# EAGLE design control-10 (EAGLE 7.7.0)
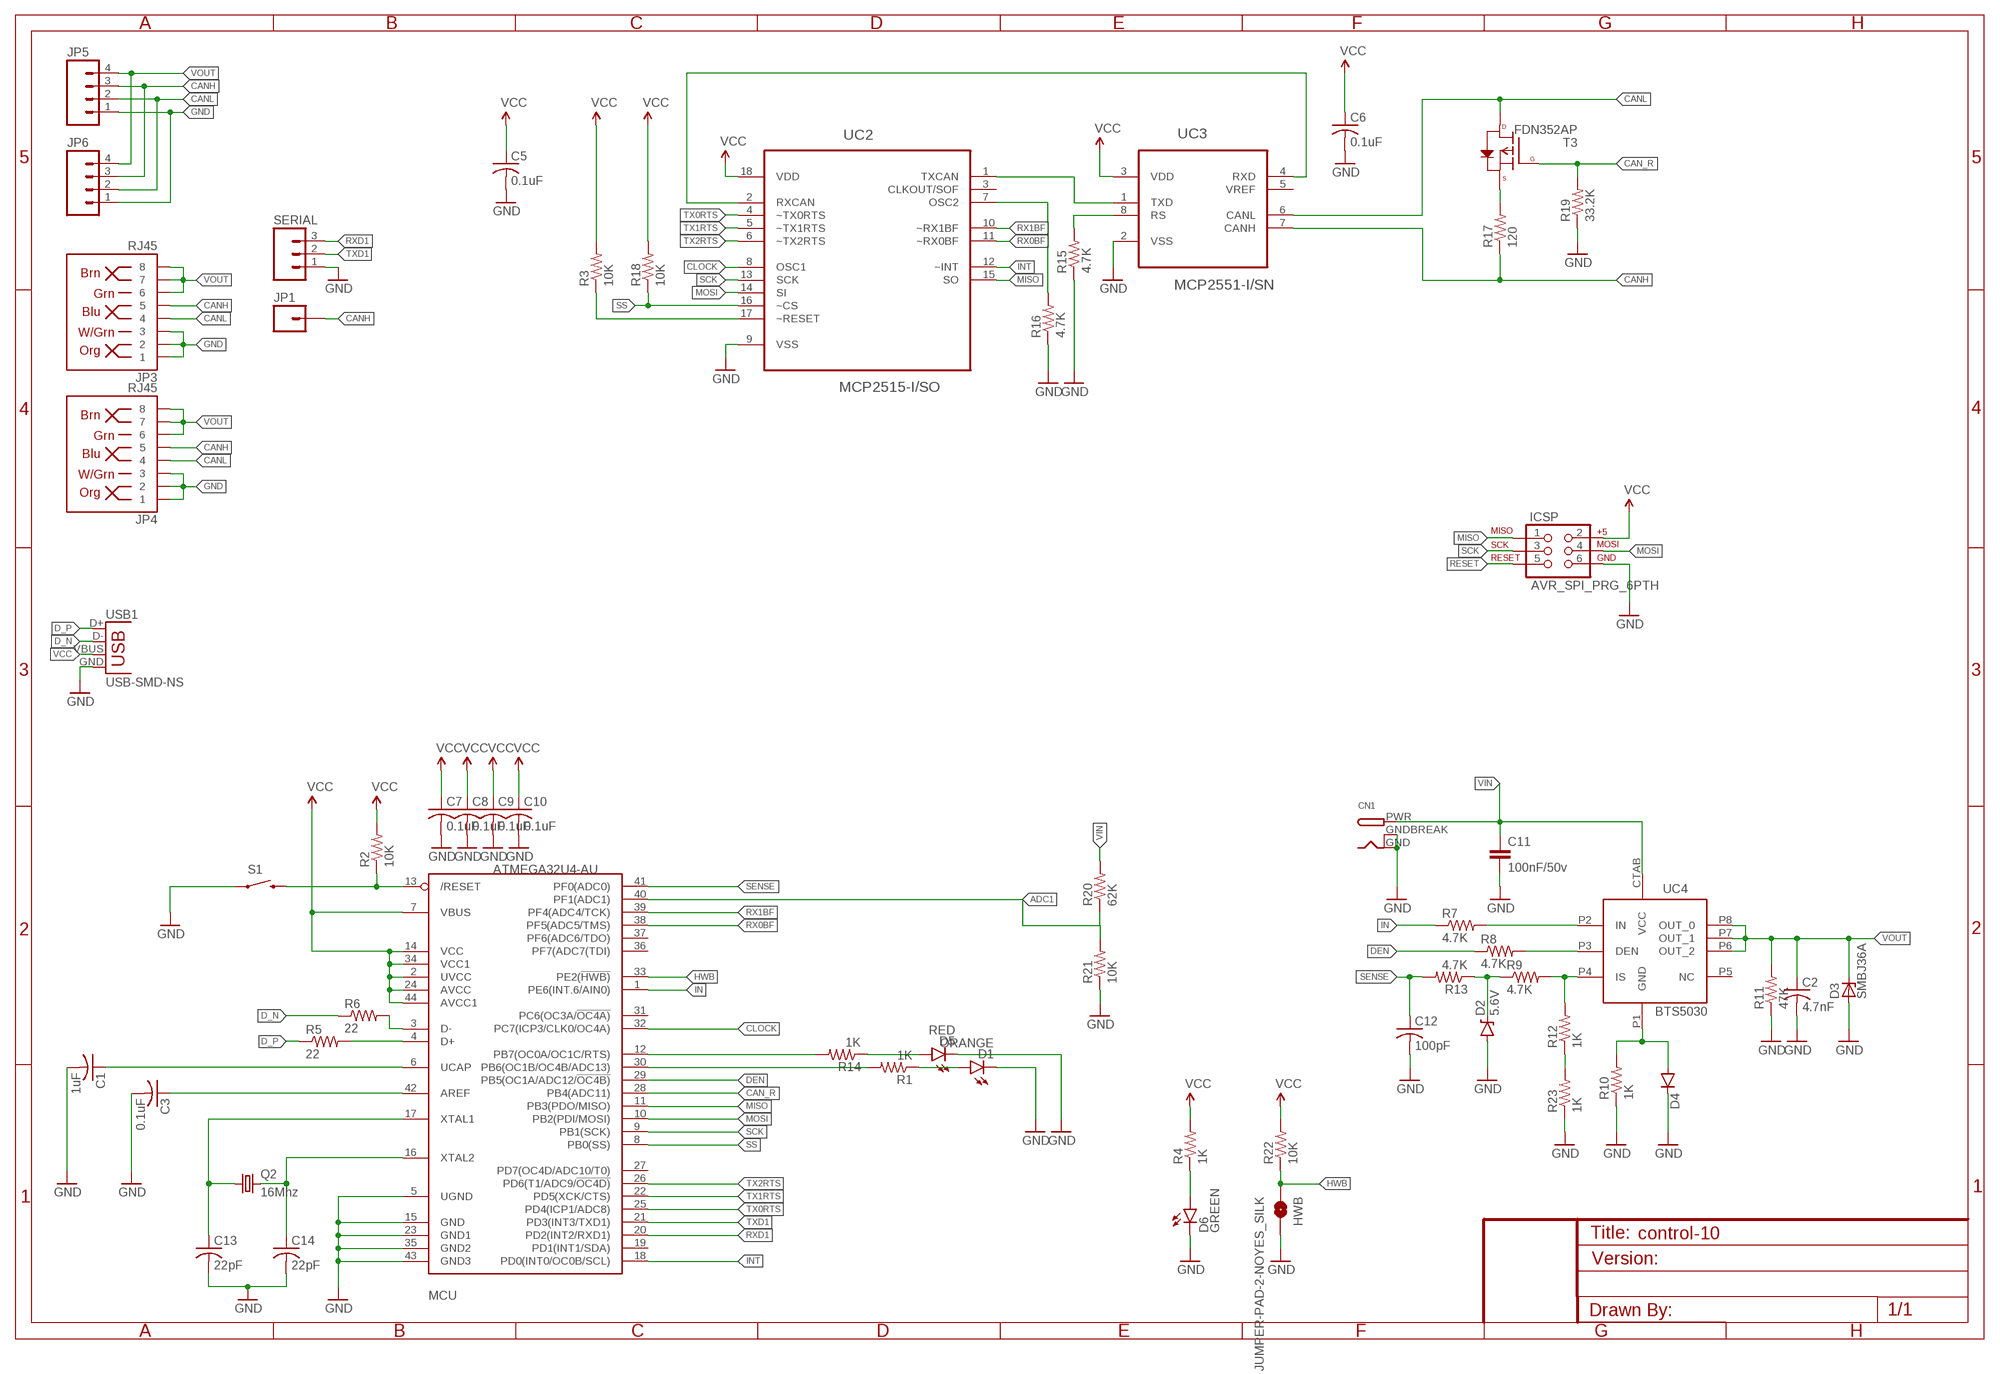
[diagram p0: schematic, sheet 1]

## Parts
C1  1uF  C-USC0805  [C0805]
C2  4.7nF  C-USC0805  [C0805]
C3  0.1uF  C-USC0603  [C0603]
C5  0.1uF  C-USC0603  [C0603]
C6  0.1uF  C-USC0603  [C0603]
C7  0.1uF  C-USC0603  [C0603]
C8  0.1uF  C-USC0603  [C0603]
C9  0.1uF  C-USC0603  [C0603]
C10  0.1uF  C-USC0603  [C0603]
C11  100nF/50v  CAP0805  [0805]
C12  100pF  C-USC0805  [C0805]
C13  22pF  C-USC0805  [C0805]
C14  22pF  C-USC0805  [C0805]
CN1  DCBARRELPTH  [DCJACK_2MM_PTH]
D1  ORANGE  LED1206  [LED-1206]
D2  5.6V  DIODE-ZENER5.6V  [SOD-323]
D3  SMBJ36A  ZENER-DIODESMB  [SMB]
D4  DIODESMA  [SMA-DIODE]
D5  RED  LED1206  [LED-1206]
D6  GREEN  LED1206  [LED-1206]
HWB  JUMPER-PAD-2-NOYES_SILK  [PAD-JUMPER-2-NO_YES_SILK]
ICSP  AVR_SPI_PRG_6PTH  [2X3]
JP1  M01NOSILK-KIT  [1X01NS-KIT]
JP3  RJ45  RJ45-8PTH  [RJ45-8]
JP4  RJ45  RJ45-8PTH  [RJ45-8]
JP5  M04SCREW  [SCREWTERMINAL-3.5MM-4]
JP6  M04SCREW  [SCREWTERMINAL-3.5MM-4]
MCU  ATMEGA32U4-AU  [TQFP44]
Q2  16Mhz  CRYSTALSMD  [HC49UP]
R1  1K  RESISTOR0805-RES  [0805]
R2  10K  R-US_M0805  [M0805]
R3  10K  R-US_M0805  [M0805]
R4  1K  RESISTOR0805-RES  [0805]
R5  22  R-US_M0805  [M0805]
R6  22  R-US_M0805  [M0805]
R7  4.7K  R-US_M0805  [M0805]
R8  4.7K  R-US_M0805  [M0805]
R9  4.7K  R-US_M0805  [M0805]
R10  1K  R-US_M0805  [M0805]
R11  47K  R-US_M0805  [M0805]
R12  1K  R-US_M0805  [M0805]
R13  4.7K  R-US_M0805  [M0805]
R14  1K  RESISTOR0805-RES  [0805]
R15  4.7K  R-US_M0805  [M0805]
R16  4.7K  R-US_M0805  [M0805]
R17  120  R-US_M0805  [M0805]
R18  10K  R-US_M0805  [M0805]
R19  33.2K  R-US_M0805  [M0805]
R20  62K  R-US_M0805  [M0805]
R21  10K  R-US_M0805  [M0805]
R22  10K  R-US_M0805  [M0805]
R23  1K  R-US_M0805  [M0805]
S1  SWITCH-MOMENTARY-2SMD-1101NE  [TACTILE-SWITCH-1101NE]
SERIAL  M03PTH  [1X03]
T3  FDN352AP  P-CHANNEL-MOSFET  [SOT23-3]
UC2  MCP2515-I/SO  [SOIC127P1034X264-18N]
UC3  MCP2551-I/SN  [SOIC127P600X175-8N]
UC4  BTS5030  [PG-DSO-8-43]
USB1  USB-SMD-NS  [USB-MINIB-NOSTOP]

## Nets
ADC1: MCU.40(PF1(ADC1)) R20.1 R21.2
CAN_R: MCU.28(PB4(ADC11)) R19.2 T3.1(G)
CANH: JP1.1 JP3.5 JP4.5 JP5.3 JP6.3 R17.1 UC3.7(CANH)
CANL: JP3.4 JP4.4 JP5.2 JP6.2 T3.3(D) UC3.6(CANL)
CLOCK: MCU.32(PC7(ICP3/CLK0/OC4A)) UC2.8(OSC1)
D_N: R6.1 USB1.D-
D_P: R5.1 USB1.D+
DEN: MCU.29(PB5(OC1A/ADC12/!OC4B)) R8.1
DU_N: MCU.3(D-) R6.2
DU_P: MCU.4(D+) R5.2
GND: C1.2 C2.2 C3.2 C5.2 C6.2 C7.2 C8.2 C9.2 C10.2 C11.2 C12.2 C13.2 C14.2 CN1.GND CN1.GNDBREAK D1.C D2.A D3.A D4.C D5.C D6.C HWB.2 ICSP.6 JP3.1 JP3.2 JP3.3 JP4.1 JP4.2 JP4.3 JP5.1 JP6.1 MCU.5(UGND) MCU.15(GND) MCU.23(GND1) MCU.35(GND2) MCU.43(GND3) R10.1 R11.1 R15.1 R16.1 R19.1 R21.1 R23.1 S1.1 SERIAL.1 UC2.9(VSS) UC3.2(VSS) USB1.GND
HWB: HWB.1 MCU.33(PE2(!HWB)) R22.1
IN: MCU.1(PE6(INT.6/AIN0)) R7.1
INT: MCU.18(PD0(INT0/OC0B/SCL)) UC2.12(~INT)
MISO: ICSP.1 MCU.11(PB3(PDO/MISO)) UC2.15(SO)
MOSI: ICSP.4 MCU.10(PB2(PDI/MOSI)) UC2.14(SI)
N$1: C13.1 MCU.17(XTAL1) Q2.1
N$2: D1.A R1.1
N$3: R7.2 UC4.P2(IN)
N$4: UC2.1(TXCAN) UC3.1(TXD)
N$5: C14.1 MCU.16(XTAL2) Q2.2
N$6: UC2.2(RXCAN) UC3.4(RXD)
N$7: R16.2 UC2.7(OSC2)
N$8: R12.1 R23.2
N$9: R3.1 UC2.17(~RESET)
N$10: R8.2 UC4.P3(DEN)
N$11: R15.2 UC3.8(RS)
N$13: R17.2 T3.2(S)
N$14: R9.2 R12.2 UC4.P4(IS)
N$15: D4.A R10.2 UC4.P1(GND)
N$16: MCU.12(PB7(OC0A/OC1C/RTS)) R14.2
N$17: D2.C R9.1 R13.1
N$18: MCU.30(PB6(OC1B/OC4B/ADC13)) R1.2
N$19: D5.A R14.1
N$21: C3.1 MCU.42(AREF)
N$22: D6.A R4.1
N$23: C1.1 MCU.6(UCAP)
RESET: ICSP.5 MCU.13(/RESET) R2.1 S1.2
RX0BF: MCU.38(PF5(ADC5/TMS)) UC2.11(~RX0BF)
RX1BF: MCU.39(PF4(ADC4/TCK)) UC2.10(~RX1BF)
RXD1: MCU.20(PD2(INT2/RXD1)) SERIAL.3
SCK: ICSP.3 MCU.9(PB1(SCK)) UC2.13(SCK)
SENSE: C12.1 MCU.41(PF0(ADC0)) R13.2
SS: MCU.8(PB0(SS)) R18.1 UC2.16(~CS)
TX0RTS: MCU.25(PD4(ICP1/ADC8)) UC2.4(~TX0RTS)
TX1RTS: MCU.22(PD5(XCK/CTS)) UC2.5(~TX1RTS)
TX2RTS: MCU.26(PD6(T1/ADC9/!OC4D)) UC2.6(~TX2RTS)
TXD1: MCU.21(PD3(INT3/TXD1)) SERIAL.2
VCC: C5.1 C6.1 C7.1 C8.1 C9.1 C10.1 ICSP.2 MCU.2(UVCC) MCU.7(VBUS) MCU.14(VCC) MCU.24(AVCC) MCU.34(VCC1) MCU.44(AVCC1) R2.2 R3.2 R4.2 R18.2 R22.2 UC2.18(VDD) UC3.3(VDD) USB1.VBUS
VIN: C11.1 CN1.PWR R20.2 UC4.CTAB(VCC)
VOUT: C2.1 D3.C JP3.6 JP3.7 JP3.8 JP4.6 JP4.7 JP4.8 JP5.4 JP6.4 R11.2 UC4.P6(OUT_2) UC4.P7(OUT_1) UC4.P8(OUT_0)
Unconnected: MCU.19(PD1(INT1/SDA)) MCU.27(PD7(OC4D/ADC10/T0)) MCU.31(PC6(OC3A/!OC4A)) MCU.36(PF7(ADC7(TDI)) MCU.37(PF6(ADC6/TDO)) UC2.3(CLKOUT/SOF) UC3.5(VREF) UC4.P5(NC)

## Library data of the parts
C1-C3 C5-C10 C12-C14 = rcl:C-US: CAPACITOR, American symbol
C11 = SparkFun-Capacitors:CAP: Capacitor Standard 0603 ceramic capacitor, and 0.1" leaded capacitor.
CN1 = adafruit:DCBARREL: 2.0mm DC Barrel Jack DCJACK_2MM_PTH - Through Hole Jack (4UConnector: 05537)
D1 D5 D6 = SparkFun-LED:LED: LEDs Standard schematic elements and footprints for 5mm, 3mm, 1206, and 0603 sized LEDs. 5mm - Spark Fun Electronics SKU : COM-00529 (and others)
D2 = SparkFun-DiscreteSemi:DIODE-ZENER: Zener Diode Production Part - 8199 3.4V Zener Voltage; PROD_ID: DIO-12442
D3 = diode:ZENER-DIODE: Z-Diode
D4 = SparkFun-DiscreteSemi:DIODE: Diode These are standard reverse protection diodes and small signal diodes. SMA package can handle up to about 1A. SOD-323 can handle about 200mA. What the SOD-323 package when ordering, there are some mfgs out there that are 5-pin packages.
HWB = SparkFun-Passives:JUMPER-PAD-2-NO
ICSP = SparkFun-Connectors:AVR_SPI_PRG_6: AVR ISP 6 Pin This is the reduced ISP connector for AVR programming. Common on Arduino. This footprint will take up less PCB space and can be used with a 10-pin to 6-pin adapter such as SKU: BOB-08508 **Special note about "TEST_POINT" package. The stop mask is on the top side, so if you want your programming test points to be on the bottom of your board, make sure to place this package on the bottom side of the board. This also ensure that the orientation to program from the bottom side will be correct.
JP1 = SparkFun-Connectors:M01: Header 1 Standard 1-pin 0.1" header. Use with straight break away headers (SKU : PRT-00116), right angle break away headers (PRT-00553), swiss pins (PRT-00743), machine pins (PRT-00117), and female headers (PRT-00115). SMTSO-256-ET is a "flush mount" nut for a 4-40 screw. The older package used to be too tight, and did not allow it to sit properly thru the drill hit. The latest (0.165DIA) fits nice and snug.
JP3 JP4 = SparkFun-Connectors:RJ45-8: RJ45 Jack Simple RJ45, 8-pin connection - connector for common Cat5, Cat5e, and Cat6 Ethernet cables. Footprint not yet proven in production. Connector sku is PRT-00643; Breakout PCB sku is BOB-00716.; PROD_ID: CONN-08506
JP5 JP6 = SparkFun-Connectors:M04: Header 4 Standard 4-pin 0.1" header. Use with straight break away headers (SKU : PRT-00116), right angle break away headers (PRT-00553), swiss pins (PRT-00743), machine pins (PRT-00117), and female headers (PRT-00115). Molex polarized connector foot print use with SKU : PRT-08231 with associated crimp pins and housings. 1MM SMD Version SKU: PRT-10208; PROD_ID: Combine 2x8399
MCU = adafruit:ATMEGA32U4: http://www.ladyada.net/library/eagle
Q2 = SparkFun-FreqCtrl:CRYSTAL: Various standard crystals. Proven footprints.
R1 R4 R14 = SparkFun-Resistors:RESISTOR: Resistor Basic schematic elements and footprints for 0603, 1206, and PTH resistors.
R2 R3 R5-R13 R15-R23 = resistor:R-US_: RESISTOR, American symbol
S1 = SparkFun-Electromechanical:SWITCH-MOMENTARY-2: Various NO switches- pushbuttons, reed, etc; PROD_ID: SWCH-00815
SERIAL = SparkFun-Connectors:M03: Header 3 Standard 3-pin 0.1" header. Use with straight break away headers (SKU : PRT-00116), right angle break away headers (PRT-00553), swiss pins (PRT-00743), machine pins (PRT-00117), and female headers (PRT-00115). Molex polarized connector foot print use with SKU : PRT-08232 with associated crimp pins and housings.
T3 = GeekAmmo:P-CHANNEL-MOSFET: P-Channel MOSFET Mode Field Effect Transistor
UC2 = Microchip_By_element14_Batch_1:MCP2515-I/SO: CAN Controller; MPN: MCP2515-I/SO; OC_FARNELL: 1292239; OC_NEWARK: 29H7136; PACKAGE: SOIC-18; SUPPLIER: Microchip
UC3 = Microchip_By_element14_Batch_1:MCP2551-I/SN: High-Speed CAN Transceiver; MPN: MCP2551-I/SN; OC_FARNELL: 9758569; OC_NEWARK: 69K7604; PACKAGE: SOIC-8; SUPPLIER: Microchip
UC4 = BTS5030:BTS5030
USB1 = SparkFun-Connectors:USB: USB Connectors USB-B-PTH is fully proven SKU : PRT-00139/CONN-08278 USB-miniB is fully proven SKU : PRT-00587 USB-A-PCB is untested. USB-A-H is throughly reviewed, but untested. Spark Fun Electronics SKU : PRT-00437 USB-B-SMT is throughly reviewed, but untested. Needs silkscreen touching up. USB-A-S has not been used/tested USB-MB-H has not been used/tested USB-MICROB has been used. CONN-09505

## Board
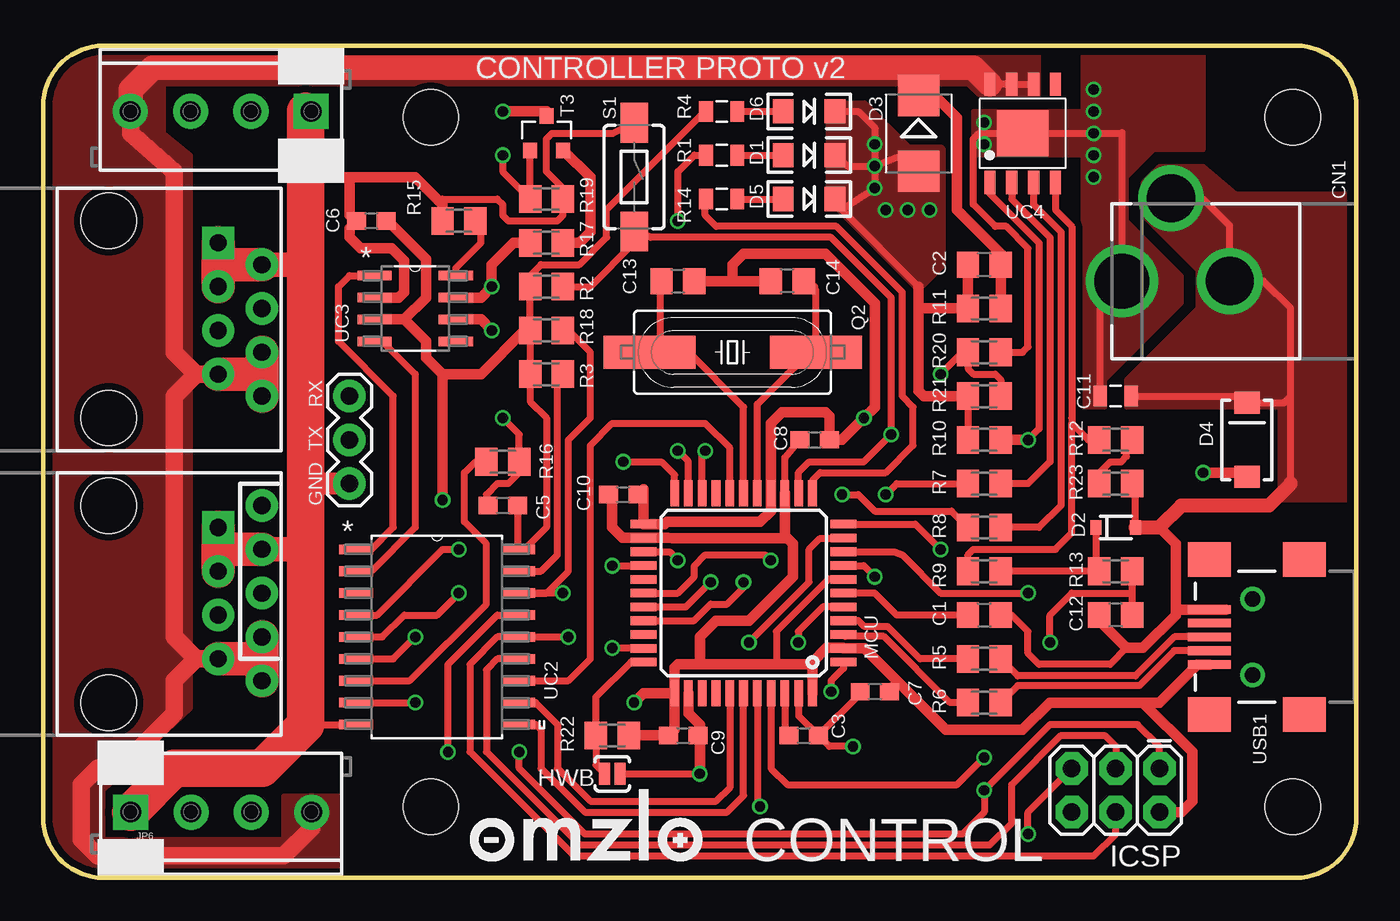
[diagram p1: board, top side]
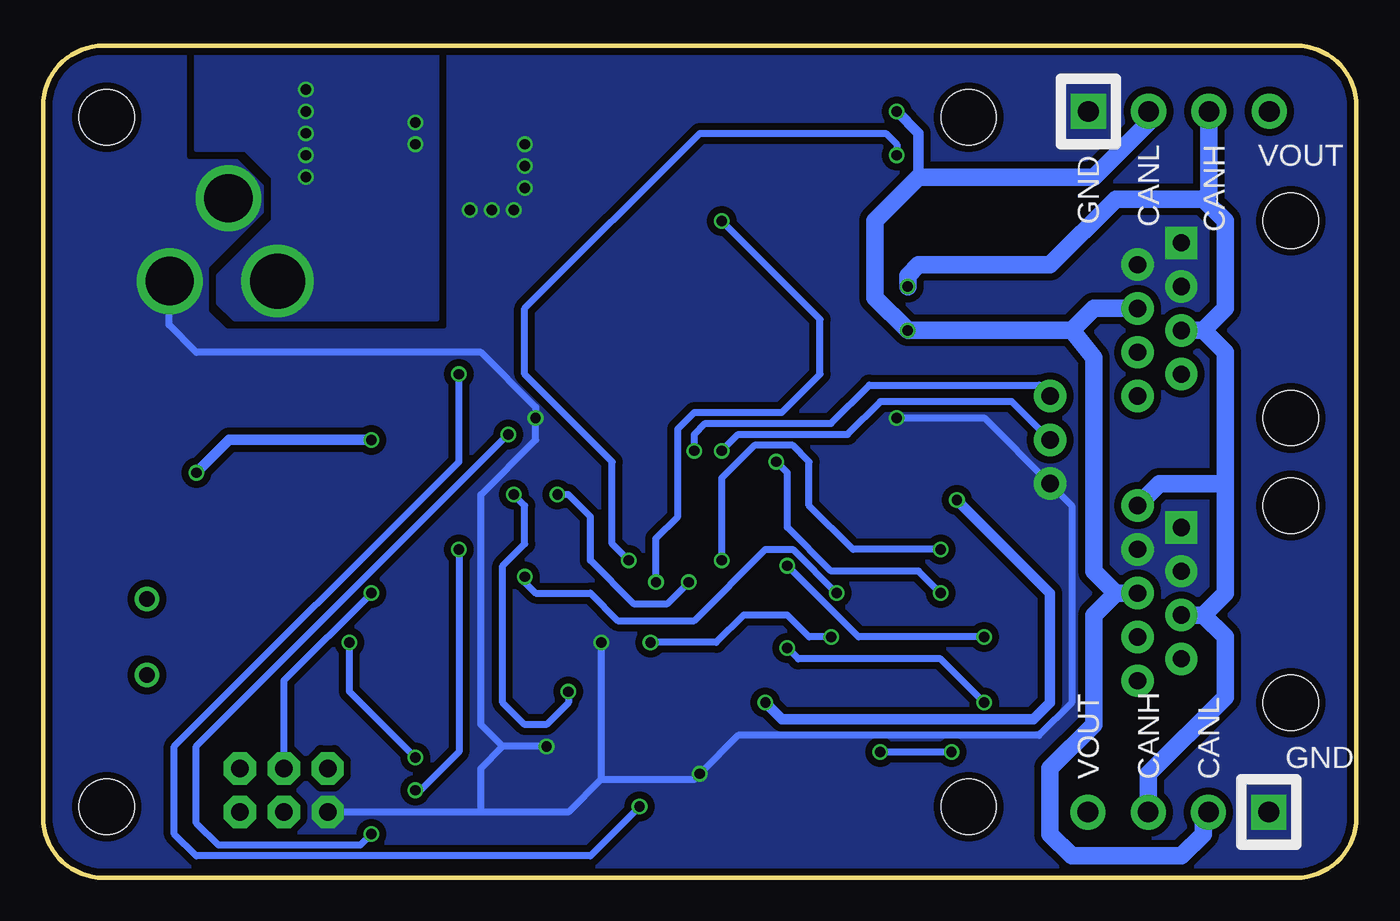
[diagram p2: board, bottom side, seen from below]

Size 76.2 x 48.26 mm. Coordinates in mm from the lower left corner, seen from the top.
Outline: 3.5,0 72.7,0 arc90 76.2,3.5 76.2,44.76 arc90 72.7,48.26 3.5,48.26 arc90 0,44.76 0,3.5 arc90 3.5,0
Copper layers (1*16): Top 0.035mm / dielectric 1.5mm / Bottom 0.035mm
Design rules "SeeedStudio_2layer_DRU_no_angle_20140221": minimum track width 6mil, minimum drill 12mil, track to track 6mil, track to pad 6mil, pad to pad 6mil, via to via 6mil, smd to smd 0mil, copper to edge 10mil, drill to drill 10mil, minimum pad ring 10mil, minimum via ring 6mil, stop-mask expansion 2mil, vias tented up to drill 100mil, thermal gap 10mil
Holes 3.2 mm at 72.5,44.12 72.5,4.12 22.5,4.12 22.5,44.12

### Footprints (pad centres in the part's own frame; a part is rotated, then mirrored left to right if it is on the bottom)
C0805 = smd 1.3 x 1.5: 1 -0.95,0; 2 0.95,0
C0603 = smd 1.1 x 1: 1 -0.85,0; 2 0.85,0
0805 = smd 0.8 x 1.2: 1 -0.9,0; 2 0.9,0
DCJACK_2MM_PTH = drill 2.8: GND 0,7.35; GNDBREAK 4.8,10.75 | drill 3.2: PWR 0,13.6
LED-1206 = smd 1.2 x 1.4: A -1.5,0; C 1.5,0
SOD-323 = smd 0.63 x 0.83: A 1.15,0; C -1.15,0
SMB = smd 2.4 x 2.4: A 2.2,0; C -2.2,0
SMA-DIODE = smd 1.27 x 1.47: A -2.15,0; C 2.15,0
PAD-JUMPER-2-NO_YES_SILK = smd 0.635 x 1.27: 1 -0.45,0; 2 0.45,0
2X3 = drill 1.016 pad 1.88 octagon: 1 0,0; 2 0,2.54; 3 2.54,0; 4 2.54,2.54; 5 5.08,0; 6 5.08,2.54
1X01NS-KIT = drill 1.016 pad 1.88: 1 0,0
RJ45-8 = drill 1 pad 1.88 square: 1 -4.445,6.35 | drill 1 pad 1.88: 2 -3.175,8.89; 3 -1.905,6.35; 4 -0.635,8.89; 5 0.635,6.35; 6 1.905,8.89; 7 3.175,6.35; 8 4.445,8.89 | hole 3.2: -5.715,0; 5.715,0
SCREWTERMINAL-3.5MM-4 = drill 1.2 pad 2.032 square: 1 0,0 | drill 1.2 pad 2.032: 2 3.5,0; 3 7,0; 4 10.5,0
TQFP44 = smd 1.5 x 0.5: 1 -5.8,4; 2 -5.8,3.2; 3 -5.8,2.4; 4 -5.8,1.6; 5 -5.8,0.8; 6 -5.8,0; 7 -5.8,-0.8; 8 -5.8,-1.6; 9 -5.8,-2.4; 10 -5.8,-3.2; 11 -5.8,-4; 23 5.8,-4; 24 5.8,-3.2; 25 5.8,-2.4; 26 5.8,-1.6; 27 5.8,-0.8; 28 5.8,0; 29 5.8,0.8; 30 5.8,1.6; 31 5.8,2.4; 32 5.8,3.2; 33 5.8,4 | smd 0.5 x 1.5: 12 -4,-5.8; 13 -3.2,-5.8; 14 -2.4,-5.8; 15 -1.6,-5.8; 16 -0.8,-5.8; 17 0,-5.8; 18 0.8,-5.8; 19 1.6,-5.8; 20 2.4,-5.8; 21 3.2,-5.8; 22 4,-5.8; 34 4,5.8; 35 3.2,5.8; 36 2.4,5.8; 37 1.6,5.8; 38 0.8,5.8; 39 0,5.8; 40 -0.8,5.8; 41 -1.6,5.8; 42 -2.4,5.8; 43 -3.2,5.8; 44 -4,5.8
HC49UP = smd 5.334 x 1.93: 1 -4.826,0; 2 4.826,0
M0805 = smd 1.3 x 1.6: 1 -0.95,0; 2 0.95,0
TACTILE-SWITCH-1101NE = smd 2.3 x 1.6: 1 -3.15,0; 2 3.15,0
1X03 = drill 1.016 pad 1.88: 1 0,0; 2 2.54,0; 3 5.08,0
SOT23-3 = smd 0.8 x 0.9: 1 -0.95,-1; 2 0.95,-1; 3 0,1
SOIC127P1034X264-18N = smd 1.981 x 0.559: 1 -4.699,5.08; 2 -4.699,3.81; 3 -4.699,2.54; 4 -4.699,1.27; 5 -4.699,0; 6 -4.699,-1.27; 7 -4.699,-2.54; 8 -4.699,-3.81; 9 -4.699,-5.08; 10 4.699,-5.08; 11 4.699,-3.81; 12 4.699,-2.54; 13 4.699,-1.27; 14 4.699,0; 15 4.699,1.27; 16 4.699,2.54; 17 4.699,3.81; 18 4.699,5.08
SOIC127P600X175-8N = smd 1.981 x 0.559: 1 -2.362,1.905; 2 -2.362,0.635; 3 -2.362,-0.635; 4 -2.362,-1.905; 5 2.362,-1.905; 6 2.362,-0.635; 7 2.362,0.635; 8 2.362,1.905
PG-DSO-8-43 = smd 2.65 x 3: CTAB 0,0 | smd 1.35 x 0.65: P1 -2.845,1.905; P2 -2.845,0.635; P3 -2.845,-0.635; P4 -2.845,-1.905; P5 2.845,-1.905; P6 2.845,-0.635; P7 2.845,0.635; P8 2.845,1.905
USB-MINIB-NOSTOP = smd 2.5 x 0.5: D+ 2.5,0; D- 2.5,0.8; GND 2.5,-1.6; ID 2.5,-0.8; VBUS 2.5,1.6 | smd 2.5 x 2: G1 -3,-4.5; G2 -3,4.5; G3 2.5,4.5; G4 2.5,-4.5 | drill 0.9 pad 0.8: H1 0,2.2 | drill 0.9 pad 0.787: H2 0,-2.2

### Placement (x,y rotation side)
C1  54.61,15.24 0 top
C2  54.61,35.56 180 top
C3  44.13,8.26 0 top
C5  26.67,21.59 180 top
C6  19.05,38.1 180 top
C7  48.26,10.79 180 top
C8  44.77,25.4 0 top
C9  37.15,8.26 0 top
C10  33.66,22.23 0 top
C11  62.23,27.94 0 top
C12  62.23,15.24 180 top
C13  36.83,34.61 0 top
C14  43.18,34.61 180 top
CN1  76.2,34.61 90 top
D1  44.45,41.91 0 top
D2  62.23,20.32 0 top
D3  50.8,43.18 270 top
D4  69.85,25.4 90 top
D5  44.45,39.37 0 top
D6  44.45,44.45 0 top
HWB  33.02,6.03 0 top
ICSP  64.77,6.35 180 top
JP1  12.7,21.59 0 top
JP3  3.81,15.88 270 top
JP4  3.81,32.38 270 top
JP5  15.56,44.45 180 top
JP6  5.08,3.81 0 top
MCU  40.64,16.51 180 top
Q2  40.01,30.48 0 top
R1  39.37,41.91 180 top
R2  29.21,34.29 180 top
R3  29.21,29.21 180 top
R4  39.37,44.45 180 top
R5  54.61,12.7 180 top
R6  54.61,10.16 180 top
R7  54.61,22.86 0 top
R8  54.61,20.32 0 top
R9  54.61,17.78 180 top
R10  54.61,25.4 0 top
R11  54.61,33.02 0 top
R12  62.23,25.4 180 top
R13  62.23,17.78 0 top
R14  39.37,39.37 180 top
R15  24.13,38.1 0 top
R16  26.67,24.13 180 top
R17  29.21,36.83 0 top
R18  29.21,31.75 180 top
R19  29.21,39.37 180 top
R20  54.61,30.48 0 top
R21  54.61,27.94 0 top
R22  33.02,8.26 0 top
R23  62.23,22.86 180 top
S1  34.29,40.64 270 top
SERIAL  17.78,22.86 90 top
T3  29.21,43.18 0 top
U$1  [OMZLO-0.5]  24.77,0.95 0 top
UC2  22.86,13.97 0 top
UC3  21.59,33.02 0 top
UC4  56.83,43.18 90 top
USB1  70.17,13.97 180 top

### Tracks (layer width: path | path; a pad name or v marks a point on that pad's centre or on a via)
ADC1  (via drill 0.6)
  Top 0.406: R21.2 55.56,28.89 55.24,29.21 53.98,29.21 53.66,29.52 R20.1 53.34,30.48 v52.07,29.21 | MCU.40 41.44,4.28 v41.59,4.13
  Bottom 0.406: v41.59,4.13 44.45,1.27 67.31,1.27 68.58,2.54 68.58,7.62 52.07,24.13 v52.07,29.21
CAN_R  (via drill 0.6)
  Top 0.406: T3.1 R19.2 26.67,40.96 v26.67,41.91 | MCU.28 36.83,16.51 37.78,17.46 37.78,18.1 38.42,18.73 41.91,18.73 v42.23,18.41
  Bottom 0.406: v42.23,18.41 43.18,19.37 43.18,24.13 48.26,29.21 48.26,33.02 38.1,43.18 27.3,43.18 26.67,42.55 v26.67,41.91
CANH  (via drill 0.6)
  Top 0.61: R17.1 27.3,36.83 26.04,35.56 v26.04,34.29 25.4,33.66 UC3.7
  Bottom 0.406: 12.06,3.83 JP6.3
  Bottom 1.016: v26.04,34.29 26.04,34.92 25.4,35.56 17.78,35.56 13.97,39.37 8.89,39.37 | 8.89,39.37 7.62,38.1 7.62,33.02 8.89,31.75 | JP4.5 8.89,31.75 | 8.89,31.75 7.62,30.48 7.62,22.86 | 7.62,22.86 7.62,16.51 8.89,15.24 | JP3.5 8.89,15.24 | 8.89,15.24 7.62,13.97 7.62,10.48 12.06,6.03 12.06,3.83 | JP5.3 8.56,39.7 8.89,39.37 | JP1.1 11.43,22.86 7.62,22.86
CANL  (via drill 0.6)
  Top 0.406: 29.21,44.45 T3.3
  Top 0.61: UC3.6 25.4,32.38 v26.04,31.75 | v26.67,44.45 29.21,44.45
  Bottom 0.61: 25.4,40.64 25.4,43.18 v26.67,44.45
  Bottom 1.016: 16.51,31.75 v26.04,31.75 27.94,33.66 27.94,38.1 25.4,40.64 15.24,40.64 12.06,43.82 JP5.2 | 16.51,31.75 15.24,33.02 JP4.4 | 16.51,31.75 15.24,30.16 15.24,17.78 13.97,16.51 | 13.97,16.51 JP3.4 | 13.97,16.51 15.24,15.24 15.24,8.89 17.78,6.35 17.78,2.54 16.51,1.27 10.16,1.27 8.89,2.54 8.89,3.5 JP6.2
CLOCK  (via drill 0.6)
  Top 0.406: UC2.8 v21.59,10.16 | v33.02,13.34 34.81,13.34 MCU.32
  Bottom 0.406: v21.59,10.16 24.13,12.7 32.38,12.7 v33.02,13.34
D_N
  Top 0.406: USB1.D- 65.64,13.17 63.62,11.15 56.55,11.15 R6.1
D_P
  Top 0.406: USB1.D+ 65.64,13.97 63.38,11.71 56.55,11.71 R5.1
DEN  (via drill 0.6)
  Top 0.406: MCU.29 37.3,15.71 v38.73,17.14 | v46.35,22.23 47.31,22.23 48.26,21.27 52.7,21.27 R8.1
  Bottom 0.406: v38.73,17.14 40.01,15.88 41.91,15.88 44.45,18.41 44.45,20.95 45.72,22.23 v46.35,22.23
DU_N
  Top 0.406: R6.2 52.63,10.16 48.78,14.01 46.54,14.01 MCU.3
DU_P
  Top 0.406: R5.2 50.88,12.7 49.01,14.57 47.66,14.57 47.31,14.92 46.45,14.92 MCU.4
GND  (via drill 0.6, 0.6 pad 0.81)
  Top 0.406: 67.31,39.37 CN1.GNDBREAK 65.81,39.37 67.31,39.37 | 67.31,39.37 68.85,37.83 CN1.GND 70.8,34.61 72.39,33.02 72.39,27.94 | HWB.2 v38.1,6.03 | 38.1,8.15 C9.2 38.1,8.36 | MCU.43 43.84,9.4 C3.2 | C7.2 47.41,10.68 C3.2 | MCU.5 45.24,15.71 43.81,14.29 v43.81,13.65 | v46.99,7.62 45.62,7.62 C3.2 | v48.26,41.27 49.87,41.91 D3.A | D6.C 47.31,44.45 48.26,43.5 v48.26,42.55 v48.26,41.27 | v48.26,41.27 v48.26,40.01 46.35,38.73 | 46.35,38.73 46.04,39.05 D5.C | D1.C 46.35,41.59 46.67,41.27 v48.26,41.27 | C12.2 61.28,14.92 | 68.63,15.56 USB1.GND | D2.A 63.38,22.66 R23.1 | 72.39,22.86 72.39,27.94 | 72.39,27.94 72,27.55 D4.C 69.29,27.94 C11.2 | 15.56,44.77 15.24,44.45 | 15.24,8.89 UC2.9 | R21.1 R10.1 | 50.8,34.29 46.35,38.73 | C5.2 25.72,21.69 25.72,22.23 26.35,22.86 26.99,22.86 27.62,23.49 R16.1 27.62,25.72 v26.67,26.67 | 42.23,22.3 MCU.15 42.23,22.32 | 23.18,38.42 23.18,39.37 26.35,39.37 26.67,39.05 26.67,38.42 26.99,38.1 29.84,38.1 30.16,38.42 R19.1 30.16,40.01 29.21,40.96 29.21,42.86 29.53,43.18 33.05,43.18 S1.1 | 34.84,22.52 C10.2 | 62.87,13.34 61.91,12.38 57.78,12.38 57.15,13.02 57.15,14.29 56.2,15.24 C1.2 | 17.78,37.68 C6.2 18.1,38.1
  Top 0.61: v38.1,6.03 38.1,8.15 | MCU.35 37.44,9.55 38.1,8.89 38.1,8.36 | 40.01,34.61 C13.2 | 40.01,34.61 C14.2 | 40.01,34.61 40.01,35.56 40.64,36.2 45.4,36.2 48.26,33.34 48.26,27.3 v47.62,26.67 46.35,25.4 C8.2 45.62,26.77 45.4,26.99 42.86,26.99 42.23,26.35 42.23,22.32 | 61.28,14.92 62.87,13.34 63.82,13.34 65.72,15.24 65.72,15.56 | 65.72,15.56 68.63,15.56 | 64.77,20.32 65.72,19.37 65.72,15.56 | UC3.2 20.64,33.66 20.95,33.97 20.95,35.77 20.22,36.51 18.41,36.51 17.78,37.15 17.78,37.68 | C2.2 R11.1 50.8,33.02 | 50.8,33.02 50.8,28.26 51.12,27.94 R21.1 | 50.8,33.02 50.8,34.29 | 42.23,22.3 42.23,21.27 41.59,20.64 36.2,20.64 36.07,20.51 MCU.23 34.84,22.52 | R15.1 23.18,38.42 23.18,39.05 21.59,40.64 17.78,40.64 | 17.78,40.64 15.24,40.64 | 18.1,38.1 17.78,38.42 17.78,40.64
  Top 0.813: D2.A 64.77,20.32 66.04,21.59 71.12,21.59 72.39,22.86
  Top 1.27: JP5.1 15.56,44.77 | SERIAL.1 15.24,22.86
  Top 1.422: JP3.2 15.24,19.05 | JP4.2 15.24,35.56
  Top 1.93: JP3.3 10.16,19.05 | 10.16,19.05 JP3.1 | JP3.2 10.16,19.05 | JP4.1 10.16,35.56 | 10.16,35.56 JP4.3 | JP4.2 10.16,35.56
  Top 2.184: 15.24,44.45 15.24,40.64 15.24,35.56 15.24,22.86 15.24,19.05 15.24,8.89 12.7,6.35 7.62,6.35 JP6.1
  Bottom 0.406: v43.81,13.65 43.81,5.71 | 43.81,5.71 45.72,3.81 50.8,3.81 | 50.8,3.81 ICSP.6 | 50.8,3.81 50.8,6.35 49.53,7.62 | 43.81,5.71 38.42,5.71 v38.1,6.03 35.88,8.26 18.41,8.26 16.51,10.16 16.51,21.59 SERIAL.1 21.59,26.67 v26.67,26.67 | v46.99,7.62 49.53,7.62 | 49.53,7.62 50.8,8.89 50.8,22.23 47.62,25.4 v47.62,26.67 47.62,27.3 50.8,30.48 67.31,30.48 68.9,32.07 68.9,34.56 CN1.GND
  other vias: 48.9,38.73 50.16,38.73 51.44,38.73
  pour Bottom (isolate 0.406, rank 2, no thermals): 0,48.26 0,0 76.2,0 76.2,48.26
  pour Top (isolate 0.406, no thermals): 76.2,39.69 69.22,39.69 67.31,41.27 64.77,41.27 63.82,40.32 63.82,38.42 66.99,35.24 66.99,33.02 62.87,28.89 62.87,27.3 71.75,27.3 71.75,21.91 76.2,21.91
  pour Top (no thermals): 45.72,44.77 45.72,39.05 46.04,39.05 50.8,34.29 52.07,35.56 52.07,42.23 50.16,42.23 47.62,44.77
HWB
  Top 0.406: MCU.33 34.1,12.51 32.07,10.48 R22.1 32.07,6.53 HWB.1
IN  (via drill 0.6)
  Top 0.406: MCU.1 46.44,12.15 45.72,11.43 v45.72,10.79 | v48.9,22.23 49.53,22.86 R7.1
  Bottom 0.406: v45.72,10.79 45.72,10.16 46.99,8.89 48.26,8.89 49.53,10.16 49.53,18.1 48.26,19.37 48.26,21.59 v48.9,22.23
INT
  Top 0.406: UC2.12 30.48,11.43 31.75,12.7 31.75,25.08 33.02,26.35 38.42,26.35 39.84,24.93 MCU.18
MISO  (via drill 0.6)
  Top 0.406: ICSP.1 64.77,7.62 63.5,8.89 58.42,8.89 v54.61,5.08 54.61,3.81 53.34,2.54 31.43,2.54 27.62,6.35 v27.62,7.3 | v23.5,7.3 23.5,12.38 26.35,15.24 UC2.15 | MCU.11 50.61,20.51 v52.07,19.05
  Bottom 0.406: v27.62,7.3 v23.5,7.3 | v52.07,19.05 52.07,7.3 54.29,5.08 v54.61,5.08
MOSI  (via drill 0.6)
  Top 0.406: ICSP.4 62.23,2.54 60.96,1.27 30.8,1.27 24.77,7.3 24.77,12.38 26.35,13.97 UC2.14 v30.48,13.97 | v40.96,13.65 44.45,17.14 44.45,19.05 45.09,19.68 46.41,19.68 MCU.10
  Bottom 0.406: v30.48,13.97 31.75,13.97 33.02,15.24 35.56,15.24 37.15,13.65 v40.96,13.65
N$1
  Top 0.406: MCU.17 40.64,27.3 37.47,30.48 Q2.1 | 34.92,29.84 Q2.1 | Q2.1 35.56,30.48 35.81,30.73 35.81,34.22 C13.1
N$2
  Top 0.406: R1.1 D1.A
N$3
  Top 0.406: UC4.P2 56.2,39.37 58.42,37.15 58.42,24.13 57.15,22.86 R7.2
N$4
  Top 0.406: UC2.1 19.05,19.05 20.32,20.32 20.32,27.94 17.14,31.11 17.14,34.29 17.78,34.92 UC3.1
N$5
  Top 0.406: MCU.16 41.44,27.47 43.18,29.21 44.51,30.48 Q2.2 44.83,34.04 44.77,34.29 44.2,34.54 C14.1
N$6
  Top 0.406: UC3.4 19.68,31.11 21.59,29.21 21.59,20.32 19.05,17.78 UC2.2
N$7
  Top 0.406: UC2.7 21.27,11.43 25.72,15.88 25.72,19.37 24.45,20.64 24.45,23.5 25.08,24.13 R16.2
N$8
  Top 0.406: R23.2 61.28,23.5 61.91,24.13 62.55,24.13 62.87,24.45 62.87,25.09 R12.1
N$9
  Top 0.406: UC2.17 28.89,17.78 29.84,18.73 29.84,28.89 R3.1
N$10
  Top 0.406: UC4.P3 57.47,39.05 59.05,37.47 59.05,21.59 57.78,20.32 R8.2
N$11
  Top 0.406: UC3.8 23.95,35.38 25.4,36.83 25.4,37.78 R15.2
N$13
  Top 0.406: T3.2 30.21,42.18
  Top 0.61: 30.21,42.18 31.75,40.64 31.75,37.47 31.11,36.83 R17.2
N$14
  Top 0.406: UC4.P4 58.74,38.73 59.69,37.78 59.69,26.67 59.69,26.35 | 59.69,26.35 60.64,25.4 R12.2 | R9.2 53.66,18.73 53.98,19.05 58.74,19.05 59.69,20 59.69,26.35
N$15  (via drill 0.6)
  Top 0.406: UC4.P1 54.93,39.69 57.78,36.83 57.78,26.04 v57.15,25.4 | D4.A 69.46,23.25
  Top 0.61: 69.46,23.25 69.22,23.5 v67.31,23.5 | v57.15,25.4 R10.2
  Bottom 0.61: v67.31,23.5 65.41,25.4 v57.15,25.4
N$16
  Top 0.406: MCU.12 44.64,23.05 45.09,23.5 48.9,23.5 50.48,25.08 50.48,27.3 49.85,27.94 49.85,33.97 46.04,37.78 39.05,37.78 38.42,38.42 38.42,39.32 R14.2
N$17
  Top 0.406: R9.1 R13.1 61.08,17.98 D2.C
N$18  (via drill 0.6)
  Top 0.406: MCU.30 37.77,14.91 38.73,15.88 39.69,15.88 40.64,16.83 v40.64,17.14 | v36.83,38.1 36.83,40.96 37.78,41.91 R1.2
  Bottom 0.406: v40.64,17.14 40.64,19.68 39.37,20.95 39.37,26.04 38.42,26.99 33.34,26.99 31.11,29.21 31.11,32.38 v36.83,38.1
N$19
  Top 0.406: R14.1 D5.A
N$21
  Top 0.406: MCU.42 43.04,8.65 C3.1
N$22
  Top 0.406: R4.1 D6.A
N$23
  Top 0.406: C1.1 49.53,15.24 48.26,16.51 MCU.6
RESET  (via drill 0.6, 0.6 pad 0.81)
  Top 0.406: MCU.13 43.84,23.52 44.45,24.13 47.62,24.13 v49.21,25.72 49.21,33.66 45.72,37.15 35.27,37.15 S1.2 34.29,36.83 31.75,34.29 R2.1 | v57.15,2.54 57.15,3.81 ICSP.5
  Bottom 0.406: v49.21,25.72 67.31,7.62 67.31,3.17 66.04,1.91 57.78,1.91 v57.15,2.54
RX0BF
  Top 0.406: UC2.11 28.57,10.16 29.84,8.89 29.84,6.35 31.75,4.45 39.05,4.45 39.84,5.23 MCU.38
RX1BF
  Top 0.406: UC2.10 28.57,8.89 28.89,8.57 28.89,6.35 31.43,3.81 39.69,3.81 40.64,4.76 MCU.39
RXD1  (via drill 0.6)
  Top 0.406: MCU.20 38.24,24.59 v38.42,24.77
  Bottom 0.406: v38.42,24.77 38.42,25.72 37.78,26.35 30.48,26.35 28.26,28.57 18.41,28.57 SERIAL.3
SCK  (via drill 0.6)
  Top 0.406: UC2.13 26.35,12.7 25.72,12.06 25.72,7.3 31.11,1.91 54.93,1.91 56.2,3.17 56.2,5.4 59.05,8.26 61.59,8.26 62.23,7.62 ICSP.3 | MCU.9 49.39,18.91 49.85,18.73 52.07,16.51 v57.15,16.51
  Bottom 0.406: v57.15,16.51 62.23,11.43 ICSP.3
SENSE  (via drill 0.6)
  Top 0.406: R13.2 63.18,16.51 | 63.18,16.51 C12.1 | MCU.41 42.24,6.34 43.18,5.4 53.02,5.4 v54.61,6.99 | v58.42,13.65 58.42,15.24 59.69,16.51 63.18,16.51
  Bottom 0.406: v54.61,6.99 58.42,10.79 v58.42,13.65
SS  (via drill 0.6)
  Top 0.406: R18.1 30.48,31.75 31.75,30.48 31.75,26.67 30.48,25.4 30.48,17.78 29.21,16.51 UC2.16 v30.16,16.51 | MCU.8 47.61,18.11 v48.26,17.46
  Bottom 0.406: v48.26,17.46 48.26,17.14 47.62,16.51 44.45,16.51 42.86,14.92 38.42,14.92 34.29,19.05 32.7,19.05 v30.16,16.51
TX0RTS  (via drill 0.6)
  Top 0.406: UC2.4 19.37,15.24 23.18,19.05 v24.13,19.05 | MCU.25 36.37,18.91 v36.83,18.41
  Bottom 0.406: v24.13,19.05 29.21,19.05 31.75,21.59 31.75,24.13 32.7,25.08 34.92,25.08 36.83,23.18 v36.83,18.41
TX1RTS  (via drill 0.6)
  Top 0.406: UC2.5 19.68,13.97 20.95,15.24 22.86,15.24 v24.13,16.51 | v33.66,24.13 35.88,24.13 36.64,23.37 MCU.22
  Bottom 0.406: v24.13,16.51 25.4,17.78 30.48,17.78 33.02,20.32 33.02,23.5 v33.66,24.13
TX2RTS  (via drill 0.6)
  Top 0.406: UC2.6 20.32,12.7 v21.59,13.97 | v33.02,18.1 34.83,18.1 MCU.26
  Bottom 0.406: v21.59,13.97 28.89,13.97 v33.02,18.1
TXD1  (via drill 0.6)
  Top 0.406: MCU.21 37.44,24.16 v36.83,24.77
  Bottom 0.406: v36.83,24.77 35.88,25.72 29.53,25.72 27.62,27.62 20,27.62 SERIAL.2
VCC  (via drill 0.6)
  Top 0.406: MCU.14 43.04,24.37 C8.1 | R4.2 38.42,44.45 32.7,38.73 32.7,37.15 31.11,35.56 28.89,35.56 28.26,34.93 R2.2 R18.2 | R18.2 R3.2 28.26,27.62 29.21,26.67 29.21,20.32 27.94,19.05 UC2.18 27.52,19.09 C5.1 | C7.1 49.11,11.01 49.53,11.43 | 36.64,8.6 C9.1 | 46.41,13.34 MCU.2 | MCU.7 45.57,17.31 42.55,14.29 42.55,12.38 | R18.2 27.94,31.75 | 43.04,19.82 43.5,19.37 | 33.02,22.01 C10.1 | 20.32,37.78 20.22,38.42 C6.1
  Top 0.61: MCU.2 47.65,13.31 49.53,11.43 52.39,8.57 56.83,8.57 58.42,10.16 63.82,10.16 | USB1.VBUS 66.98,12.37 64.77,10.16 63.82,10.16 | ICSP.2 66.04,3.81 66.67,4.45 66.67,7.3 63.82,10.16 | MCU.34 36.64,8.6 | R22.2 C9.1 | MCU.34 36.64,12.19 36.83,12.38 38.1,12.38 | 38.1,12.38 42.55,12.38 44.45,12.38 44.64,12.51 | MCU.44 44.64,12.51 | 38.1,12.38 38.1,13.97 39.05,14.92 40.96,14.92 43.5,17.46 43.5,19.37 43.18,19.68 36.51,19.68 36.22,19.71 MCU.24 33.63,19.71 33.02,20.32 33.02,22.01 | 27.94,31.75 25.4,29.21 23.18,29.21 | 23.18,29.21 22.23,30.16 22.23,31.11 20.95,32.38 | MCU.14 43.04,19.82 | MCU.34 34.84,10.71 v34.29,10.16 | v23.18,21.91 23.18,29.21 | UC3.3 20.95,32.38 | 20.95,32.38 22.23,33.66 22.23,35.88 20.32,37.78 | 46.41,13.34 45.47,13.34 44.64,12.51
  Bottom 0.61: v34.29,10.16 33.34,9.21 18.73,9.21 17.78,10.16 17.78,16.51 v23.18,21.91
VIN  (via drill 0.6 pad 0.81)
  Top 0.406: R20.2 56.83,30.48 57.15,30.8 57.15,36.51 55.88,37.78 55.24,37.78 53.98,39.05 53.98,42.86 54.29,43.18 UC4.CTAB v60.96,43.18 62.55,43.18 62.6,43.23 CN1.PWR 61.33,34.61 C11.1
  other vias: 60.96,45.72 60.96,44.45 60.96,41.91 60.96,40.64 54.61,43.81 54.61,42.55
  pour Top (isolate 0.406, no thermals): 60.33,44.45 53.98,44.45 53.98,41.91 60.33,41.91 60.33,27.3 61.59,27.3 61.59,28.89 66.04,33.34 66.04,34.92 62.87,38.1 62.87,40.64 64.45,42.23 67.31,42.23 67.31,48.26 60.33,48.26
  pour Bottom (isolate 0.406, no thermals): 53.34,48.26 53.34,32.38 65.09,32.38 66.04,33.34 66.04,34.92 62.87,38.1 62.87,40.64 64.45,42.23 67.31,42.23 67.31,48.26
VOUT
  Top 0.406: 5.08,44.47 JP5.4 5.08,44.43 | UC4.P8 UC4.P7 UC4.P6 | C2.1 55.56,36.2 | D3.C 51.73,45.38 51.75,46.99 | 12.7,29.21 JP4.6
  Top 0.61: C2.1 R11.2 | 55.56,36.2 53.02,38.73 53.02,44.09 51.73,45.38
  Top 1.016: 8.89,29.21 7.62,30.48 7.62,40.96 5.08,43.18 5.08,44.43 | JP4.7 8.89,29.21 | 8.89,29.21 7.62,27.94 7.62,13.97 8.89,12.7 | 8.89,12.7 JP3.7 | JP6.4 15.58,2.88 13.97,1.27 3.17,1.27 2.22,2.22 2.22,5.4 3.17,6.35 4.45,6.35 7.62,9.53 7.62,11.43 8.89,12.7
  Top 1.422: UC4.P8 53.98,46.99 51.75,46.99 6.35,46.99 5.08,45.72 5.08,44.47
  Top 1.93: JP4.7 12.7,29.21 | JP4.6 JP4.8 | JP3.7 12.7,12.7 | 12.7,12.7 JP3.6 | JP3.8 12.7,12.7
  pour Top (isolate 0.406, no thermals): 54.29,45.4 57.78,45.4 57.78,48.26 0,48.26 0,0 17.14,0 17.14,4.76 13.97,4.76 13.97,2.22 3.49,2.22 3.49,5.08 8.57,9.84 8.57,41.91 6.99,43.18 6.99,46.04 53.66,46.04

### Text on the board
tPlace: RX | TX | GND
tNames: CONTROLLER PROTO v2 | CONTROL
bNames: CANH | CANL | GND | VOUT | GND | CANL | CANH | VOUT